# Altium schematic sheet BlueSource[01].SchDoc
size A3; Organization: Altium Limited; Address1: L3, 12a Rodborough Rd; Address2: Frenchs Forest; Address3: NSW; Address4: Australia 2086
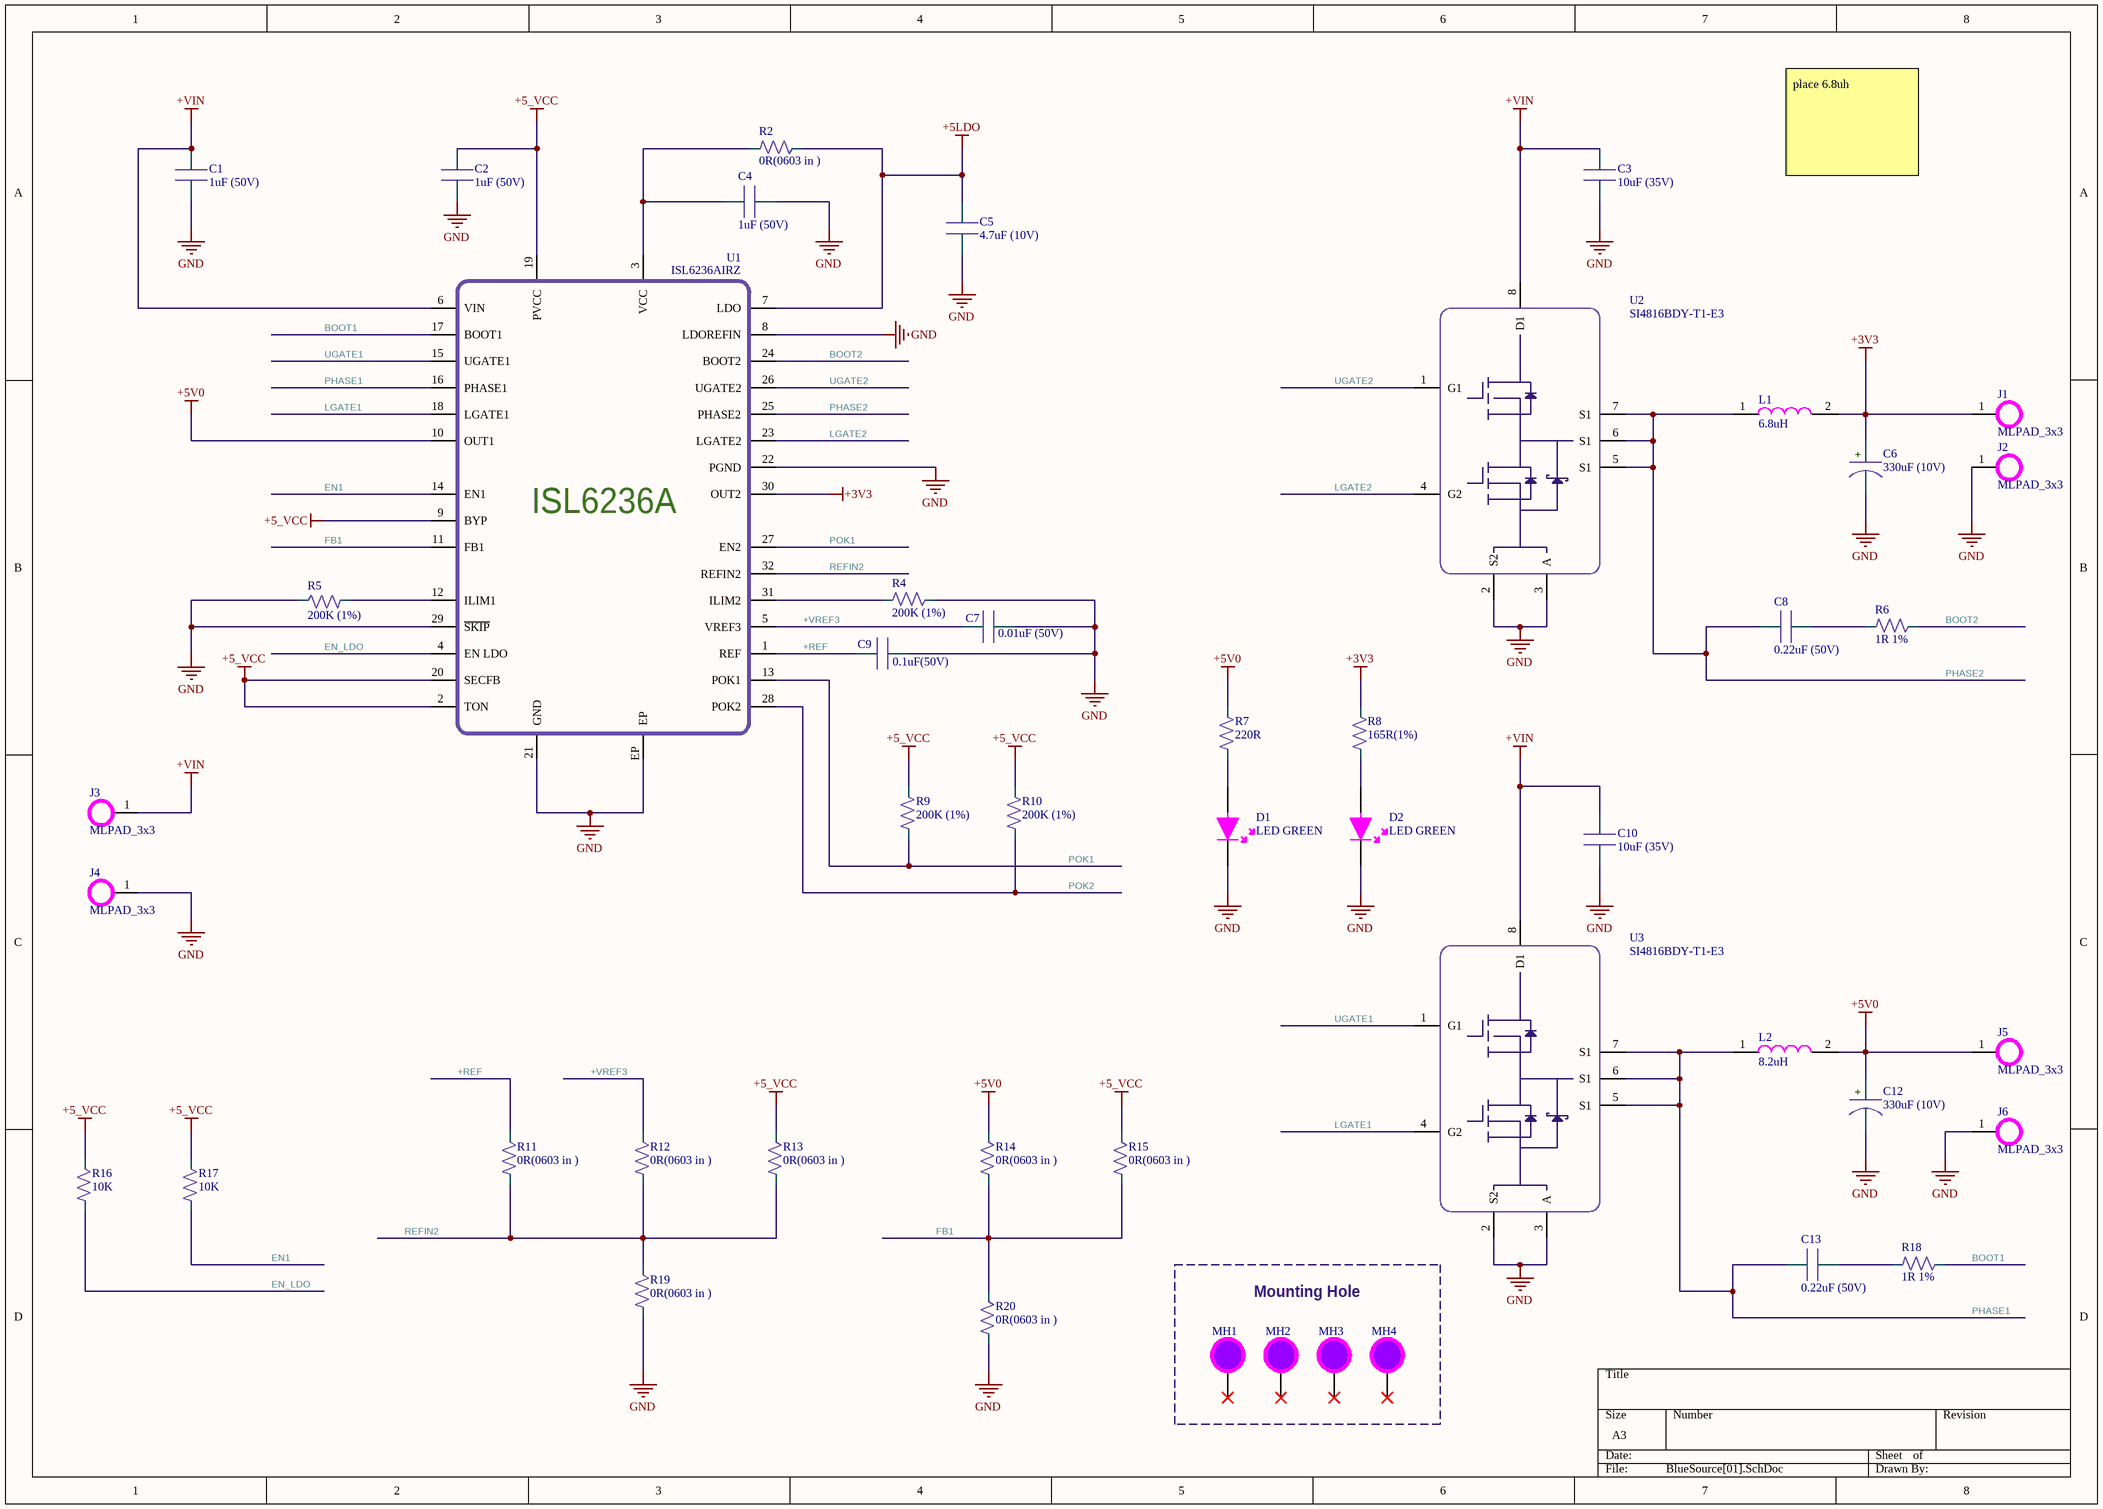
[diagram p0: BlueSource[01].SchDoc]

## Parts
C1  1uF (50V)  [Capacitor_0805]
C2  1uF (50V)  [Capacitor_0805]
C3  10uF (35V)  [Capacitor_0805]
C4  1uF (50V)  [Capacitor_0805]
C5  4.7uF (10V)  [Capacitor_0805]
C6  330uF (10V)  [C7343]
C7  0.01uF (50V)  [Capacitor_0805]
C8  0.22uF (50V)  [Capacitor_0805]
C9  0.1uF(50V)  [Capacitor_0805]
C10  10uF (35V)  [Capacitor_0805]
C12  330uF (10V)  [C7343]
C13  0.22uF (50V)  [Capacitor_0805]
D1  LED GREEN  [0603_LED]
D2  LED GREEN  [0603_LED]
J1  MLPAD_3x3  [MLPAD_3X3]
J2  MLPAD_3x3  [MLPAD_3X3]
J3  MLPAD_3x3  [MLPAD_3X3]
J4  MLPAD_3x3  [MLPAD_3X3]
J5  MLPAD_3x3  [MLPAD_3X3]
J6  MLPAD_3x3  [MLPAD_3X3]
L1  6.8uH  [DR125_Inductor]
L2  8.2uH  [DR125_Inductor]
MH1  Mounting Hole  [Mounting_Hole_3.3mm]  (value not drawn)
MH2  Mounting Hole  [Mounting_Hole_3.3mm]  (value not drawn)
MH3  Mounting Hole  [Mounting_Hole_3.3mm]  (value not drawn)
MH4  Mounting Hole  [Mounting_Hole_3.3mm]  (value not drawn)
R2  0R(0603 in )  [RESISTOR0603]
R4  200K (1%)  [RESISTOR0805]
R5  200K (1%)  [RESISTOR0805]
R6  1R 1%  [RESISTOR0805]
R7  220R  [RESISTOR0603]
R8  165R(1%)  [RESISTOR0603]
R9  200K (1%)  [RESISTOR0805]
R10  200K (1%)  [RESISTOR0805]
R11  0R(0603 in )  [RESISTOR0603]
R12  0R(0603 in )  [RESISTOR0603]
R13  0R(0603 in )  [RESISTOR0603]
R14  0R(0603 in )  [RESISTOR0603]
R15  0R(0603 in )  [RESISTOR0603]
R16  10K  [RESISTOR0805]
R17  10K  [RESISTOR0805]
R18  1R 1%  [RESISTOR0805]
R19  0R(0603 in )  [RESISTOR0603]
R20  0R(0603 in )  [RESISTOR0603]
U1  ISL6236AIRZ  [32QFN]
U2  SI4816BDY-T1-E3  [SOIC-8]
U3  SI4816BDY-T1-E3  [SOIC-8]

## Blocks framed on the sheet
Mounting Hole: MH1-MH4

## Nets
+3V3: C6.2 J1.1 L1.2 R8.2 U1.30(OUT2)
+5_VCC: C2.2 R9.2 R10.2 R13.2 R15.2 R16.2 R17.2 U1.2(TON) U1.9(BYP) U1.19(PVCC) U1.20(SECFB)
+5LDO: C5.2 R2.2 U1.7(LDO)
+5V0: C12.2 J5.1 L2.2 R7.2 R14.2 U1.10(OUT1)
+VIN: C1.2 C3.2 C10.2 J3.1 U1.6(VIN) U2.8(D1) U3.8(D1)
GND: C1.1 C2.1 C3.1 C4.2 C5.1 C6.1 C7.2 C9.2 C10.1 C12.1 D1.2 D2.2 J2.1 J4.1 J6.1 R4.2 R5.2 R19.1 R20.1 U1.8(LDOREFIN) U1.21(GND) U1.22(PGND) U1.29(~{SKIP}) U1.EP U2.2(S2) U2.3(A) U3.2(S2) U3.3(A)
+REF: C9.1 R11.2 U1.1(REF)
+VREF3: C7.1 R12.2 U1.5(VREF3)
BOOT1: R18.2 U1.17(BOOT1)
BOOT2: R6.2 U1.24(BOOT2)
EN1: R17.1 U1.14(EN1)
EN_LDO: R16.1 U1.4(EN_LDO)
FB1: R14.1 R15.1 R20.2 U1.11(FB1)
LGATE1: U1.18(LGATE1) U3.4(G2)
LGATE2: U1.23(LGATE2) U2.4(G2)
PHASE1: C13.1 L2.1 U1.16(PHASE1) U3.5(S1) U3.6(S1) U3.7(S1)
PHASE2: C8.1 L1.1 U1.25(PHASE2) U2.5(S1) U2.6(S1) U2.7(S1)
POK1: R9.1 U1.13(POK1) U1.27(EN2)
POK2: R10.1 U1.28(POK2)
REFIN2: R11.1 R12.1 R13.1 R19.2 U1.32(REFIN2)
UGATE1: U1.15(UGATE1) U3.1(G1)
UGATE2: U1.26(UGATE2) U2.1(G1)
NetC4_1: C4.1 R2.1 U1.3(VCC)
NetC8_2: C8.2 R6.1
NetC13_2: C13.2 R18.1
NetD1_1: D1.1 R7.1
NetD2_1: D2.1 R8.1
NetR4_1: R4.1 U1.31(ILIM2)
NetR5_1: R5.1 U1.12(ILIM1)

Not connected (* = marked no-connect by the designer): MH1 1*; MH2 1*; MH3 1*; MH4 1*

## Notes on the sheet
- place 6.8uh
- Title
- Size:
- Date:
- File:
- A2
- Number:
- Time:
- Revision:
- Sheet
- of
- (in symbol ISL6236AIRZ) ISL6236A
- (in symbol T530X337M010ATE004) +

## Library data of the parts
C1 C2 C4 = CC0805JKX7R9BB105: 1µF ±5% 50V Ceramic Capacitor X7R 0805 (2012 Metric); Manufacturer: Yageo; MinTemp: -55°C; MaxTemp: 125°C; ManufacturerPartNumber: CC0805JKX7R9BB105; SupplierPartNumber: 311-3498-1-ND; Supplier: Digikey; PartStatus: Active; Price: 0.35; ComponentLink1Description: SupplierURL; ComponentLink1URL: https://www.digikey.com/en/products/detail/yageo/CC0805JKX7R9BB105/7164382
C3 C10 = C2012X5R1V106K125AC: 10µF ±10% 35V Ceramic Capacitor X5R 0805 (2012 Metric); Manufacturer: TDK Corporation; MinTemp: -55°C; MaxTemp: 85°C; ManufacturerPartNumber: C2012X5R1V106K125AC; SupplierPartNumber: 445-14418-1-ND; Supplier: Digikey; PartStatus: Active; Price: 0.70000; ComponentLink1Description: SupplierURL; ComponentLink1URL: https://www.digikey.com/en/products/detail/tdk-corporation/C2012X5R1V106K125AC/3951654
C5 = C0805C475J8RACAUTO: 4.7µF ±5% 10V Ceramic Capacitor X7R 0805 (2012 Metric); Manufacturer: KEMET; MinTemp: -55°C; MaxTemp: 125°C; ManufacturerPartNumber: C0805C475J8RACAUTO; SupplierPartNumber: 399-15708-1-ND; Supplier: Digikey; PartStatus: Active; Price: 0.53; ComponentLink1Description: SupplierURL; ComponentLink1URL: https://www.digikey.com/en/products/detail/kemet/C0805C475J8RACAUTO/7427538
C6 C12 = T530X337M010ATE004: 330µF Molded Tantalum Polymer Capacitor 10V 2917 (7343 Metric) 4mOhm @ 100kHz; Manufacturer: KEMET; MinTemp: -55°C; MaxTemp: 125°C; ManufacturerPartNumber: T530X337M010ATE004; SupplierPartNumber: 399-10378-1-ND; Supplier: Digikey; PartStatus: Active; Price: 5.57; ComponentLink1Description: SupplierURL; ComponentLink1URL: https://www.digikey.com/en/products/detail/kemet/T530X337M010ATE004/3760653
C7 = C0805C103J5HACAUTO: 10000pF ±5% 50V Ceramic Capacitor X8R 0805 (2012 Metric); Manufacturer: KEMET; MinTemp: -55°C; MaxTemp: 150°C; ManufacturerPartNumber: C0805C103J5HACAUTO; SupplierPartNumber: 399-15977-1-ND; Supplier: Digikey; PartStatus: Active; Price: 0.79; ComponentLink1Description: SupplierURL; ComponentLink1URL: https://www.digikey.com/en/products/detail/kemet/C0805C103J5HACAUTO/7516211
C8 C13 = C0805C224J5RACAUTO: 0.22µF ±5% 50V Ceramic Capacitor X7R 0805 (2012 Metric); Manufacturer: 399-C0805C224J5RACAUTOCT-ND; MinTemp: -55°C; MaxTemp: 125°C; ManufacturerPartNumber: C0805C224J5RACAUTO; SupplierPartNumber: 399-C0805C224J5RACAUTOCT-ND; Supplier: Digikey; PartStatus: Active; Price: 0.84; ComponentLink1Description: SupplierURL; ComponentLink1URL: https://www.digikey.com/en/products/detail/kemet/C0805C224J5RACAUTO/10642470
C9 = C0805C104J5RACTU: 0.1µF ±5% 50V Ceramic Capacitor X7R 0805 (2012 Metric); Manufacturer: KEMET; MinTemp: -55°C; MaxTemp: 125°C; ManufacturerPartNumber: C0805C104J5RACTU; SupplierPartNumber: 399-1171-1-ND; Supplier: Digikey; PartStatus: Active; Price: 0.20; ComponentLink1Description: SupplierURL; ComponentLink1URL: https://www.digikey.com/en/products/detail/kemet/C0805C104J5RACTU/411170
D1 D2 = XZVG53W-8: Green 570nm LED Indication - Discrete 2.1V 0603 (1608 Metric); Min Temp: -40°C; Max Temp: +85°C; Manufacturer Part Number: XZVG53W-8; Supplier Part Number: 1497-1215-1-ND; Part Status: Active; Price: 0.36; ComponentLink1Description: Supplier Link; ComponentLink1URL: https://www.digikey.com/en/products/detail/sunled/XZVG53W-8/4745971
L1 = DR125-6R8-R: 6.8µH Shielded Wirewound Inductor 6.64A 12.3mOhm Nonstandard; Manufacturer: Eaton - Electronics Division; Suppplier: Digikey; MinTemp: -40°C; MaxTemp: 125°C; ManufacturerPartNumber: DR125-6R8-R; SupplierPartNumber: 513-1530-1-ND; PartStatus: Active; Price: 1.22; ComponentLink1Description: SupplierURL; ComponentLink1URL: https://www.digikey.com/en/products/detail/eaton-electronics-division/DR125-6R8-R/667158
L2 = DR125-8R2-R: 8.2µH Shielded Wirewound Inductor 5.54A 17.6mOhm Nonstandard; Manufacturer: Eaton - Electronics Division; MinTemp: -40°C; MaxTemp: 125°C; ManufacturerPartNumber: DR125-8R2-R; SupplierPartNumber: 513-1823-1-ND; Supplier: Digikey; PartStatus: Active; Price: 1.22; ComponentLink1Description: SupplierURL; ComponentLink1URL: https://www.digikey.com/en/products/detail/eaton-electronics-division/DR125-8R2-R/667161
MH1-MH4 = 3MM_MOUNTING_HOLE: 3.3mm Mounting Hole
R2 R11-R15 R19 R20 = RMCF0603ZT0R00: 0 Ohms Jumper 0.1W, 1/10W Chip Resistor 0603 (1608 Metric) Automotive AEC-Q200 Thick Film; Min Temp: -55°C; Max Temp: 155°C; Manufacturer Part Number: RMCF0603ZT0R00; Supplier Part Number: RMCF0603ZT0R00CT-ND; Part Status: Active; Price: 0.10; ComponentLink1Description: Supplier Link; ComponentLink1URL: https://www.digikey.com/en/products/detail/stackpole-electronics-inc/RMCF0603ZT0R00/1756908
R4 R5 R9 R10 = ERJ-6ENF2003V: 200 kOhms ±1% 0.125W, 1/8W Chip Resistor 0805 (2012 Metric) Automotive AEC-Q200 Thick Film; Manufacturer: Panasonic Electronic Components; MinTemp: -55°C; MaxTemp: 155°C; ManufacturerPartNumber: ERJ-6ENF2003V; SupplierPartNumber: P200KCCT-ND; Supplier: Digikey; PartStatus: Active; Price: 0.10; ComponentLink1Description: SupplierURL; ComponentLink1URL: https://www.digikey.com/en/products/detail/panasonic-electronic-components/ERJ-6ENF2003V/111933
R6 R18 = ERJ-6RQF1R0V: 1 Ohms ±1% 0.125W, 1/8W Chip Resistor 0805 (2012 Metric) Automotive AEC-Q200, Current Sense Thick Film; Manufacturer: Panasonic Electronic Components; MinTemp: -55°C; MaxTemp: 155°C; ManufacturerPartNumber: ERJ-6RQF1R0V; SupplierPartNumber: P1.0DCT-ND; Supplier: Digikey; PartStatus: Active; Price: 0.32; ComponentLink1Description: SupplierURL; ComponentLink1URL: https://www.digikey.com/en/products/detail/panasonic-electronic-components/ERJ-6RQF1R0V/250172
R7 = RMCF0603JT220R: 220 Ohms ±5% 0.1W, 1/10W Chip Resistor 0603 (1608 Metric) Automotive AEC-Q200 Thick Film; Manufacturer: Stackpole Electronics Inc; MinTemp: -55°C; MaxTemp: 155°C; ManufacturerPartNumber: RMCF0603JT220R; SupplierPartNumber: RMCF0603JT220RCT-ND; Supplier: Digikey; PartStatus: Active; Price: 0.10; ComponentLink1Description: SupplierURL; ComponentLink1URL: https://www.digikey.com/en/products/detail/stackpole-electronics-inc/RMCF0603JT220R/1758014
R8 = RMCF0603FT165R: 165 Ohms ±1% 0.1W, 1/10W Chip Resistor 0603 (1608 Metric) Automotive AEC-Q200 Thick Film; Manufacturer: Stackpole Electronics Inc; MinTemp: -55°C; MaxTemp: 155°C; ManufacturerPartNumber: RMCF0603FT165R; SupplierPartNumber: RMCF0603FT165RCT-ND; Supplier: Digikey; PartStatus: Active; Price: 0.10; ComponentLink1Description: SupplierURL; ComponentLink1URL: https://www.digikey.com/en/products/detail/stackpole-electronics-inc/RMCF0603FT165R/1713658
R16 R17 = ERJ-6GEYJ103V: 10 kOhms ±5% 0.125W, 1/8W Chip Resistor 0805 (2012 Metric) Automotive AEC-Q200 Thick Film; Manufacturer: Panasonic Electronic Components; MinTemp: -55°C; MaxTemp: 155°C; ManufacturerPartNumber: ERJ-6GEYJ103V; SupplierPartNumber: P10KACT-ND; Supplier: Digikey; PartStatus: Active; Price: 0.10; ComponentLink1Description: SupplierURL; ComponentLink1URL: https://www.digikey.com/en/products/detail/panasonic-electronic-components/ERJ-6GEYJ103V/83062
U1 = ISL6236AIRZ: - Controller, Notebook Power System Voltage Regulator IC 4 Output 32-QFN (5x5); Manufacturer: Renesas Electronics America Inc; MinTemp: -40°C; MaxTemp: 100°C; ManufacturerPartNumber: ISL6236AIRZ; SupplierPartNumber: ISL6236AIRZ-ND; Supplier: Digikey; Price: 3.90080; ComponentLink1Description: SupplierURL; ComponentLink1URL: https://www.digikey.com/en/products/detail/renesas-electronics-america-inc/ISL6236AIRZ/1976644
U2 U3 = SI4816BDY-T1-E3: Mosfet Array 2 N-Channel (Half Bridge) 30V 5.8A, 8.2A 1W, 1.25W Surface Mount 8-SO; Manufacturer: Vishay Siliconix; MinTemp: -55°C; MaxTemp: 150°C; ManufacturerPartNumber: SI4816BDY-T1-E3; SupplierPartNumber: SI4816BDY-T1-E3CT-ND; Supplier: Digikey; PartStatus: Active; Price: 1.56; SupplierURL: https://www.digikey.com/en/products/detail/vishay-siliconix/SI4816BDY-T1-E3/1656470